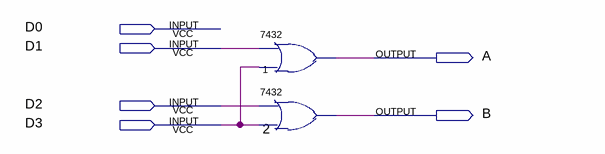
[diagram p0: schematic sheet]
// Quartus schematic 2.bdf as structural Verilog: 2 symbols, 6 pins
module \2  (
  input  D0,
  input  D1,
  input  D2,
  input  D3,
  output A,
  output B
);

  \7432  u_1 (.\2 (D1), .\3 (D3), .\1 (A));
  \7432  u_2 (.\2 (D2), .\3 (D3), .\1 (B));
endmodule
